# EAGLE design power-hat (EAGLE 9.4.2)
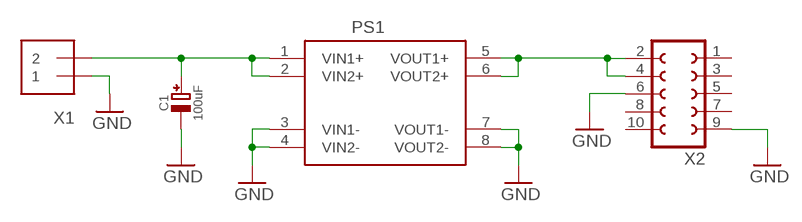
[diagram p0: schematic, sheet 1]

## Parts
C1  100uF  CAP_ELECTROLYTICPTH_3.5MMGRID_8MMDIA  [CELEC_3.5MM_8MM]
PS1  K8801MODULE  [K8801]
X1  WR_TBL_1X2-3.5MM  [WR-TBL-1X2-3.5MM]
X2  FE05-2  [FE05-2]

## Nets
GND: C1.- PS1.3(VIN1-) PS1.4(VIN2-) PS1.7(VOUT1-) PS1.8(VOUT2-) X1.1 X2.6 X2.9
N$2: C1.+ PS1.1(VIN1+) PS1.2(VIN2+) X1.2
PWR: PS1.5(VOUT1+) PS1.6(VOUT2+) X2.2 X2.4
Unconnected: X2.1 X2.3 X2.5 X2.7 X2.8 X2.10

## Library data of the parts
C1 = sanisimov:CAP_ELECTROLYTIC: Electrolytic Capacitors SMT PANASONIC_C - Size C Panasonic Electrolytic Aluminum Capacitor 47µF 16V 20% Electrolytic Capacitor [Digikey: PCE3890TR-ND] PANASONIC_D - Size D Panasonic Electrolytic Aluminum Capacitor 100µF 25V 20% Electrolytic Capacitor [Digikey: PCE3898TR-ND] PTH 3.5 mm grid, 8 mm diameter ... 3.5 mm grid, 10 mm diameter ...
PS1 = sanisimov:K8801: 7V-28V to 5V DC-DC Step Down Power Supply Module Voltage Buck Converter 3A Power Supply Board Input voltage:DC 7V-28V Output valtage:DC 5V Output current:3A. max(2A for long time) Working frequency:570KHz Size:22*17.8*5mm
X1 = sanisimov:WR_TBL_1X2-3.5MM: 3.5mm Terminal block http://www.ladyada.net/library/pcb/eaglelibrary.html
X2 = sanisimov:FE05-2: FEMALE HEADER; OC_FARNELL: unknown; OC_NEWARK: unknown

## Board
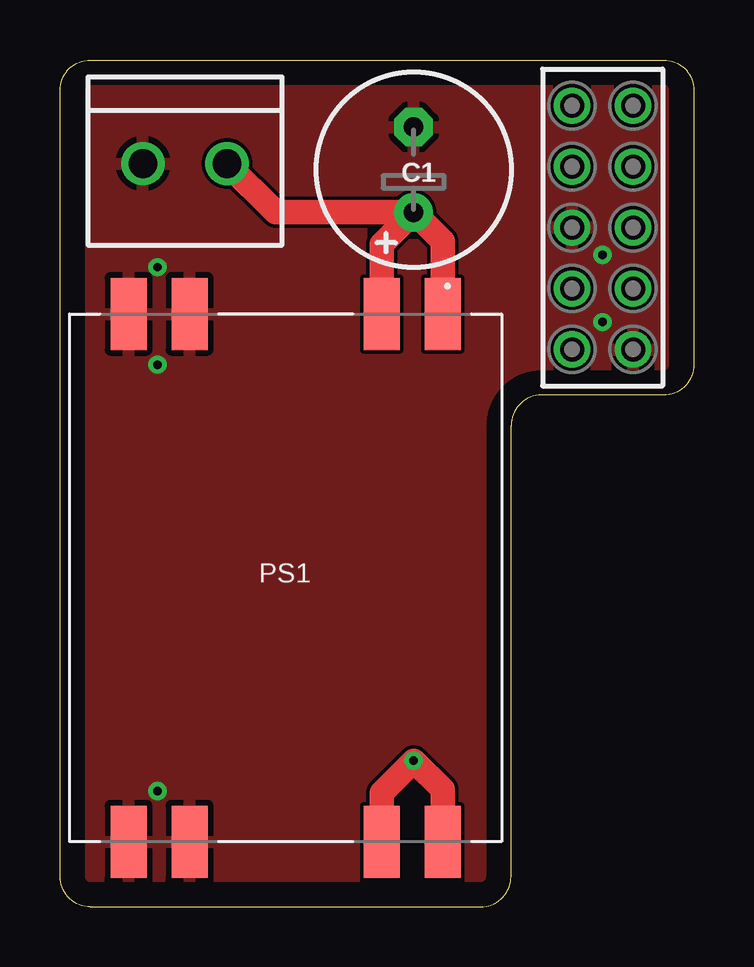
[diagram p1: board, top side]
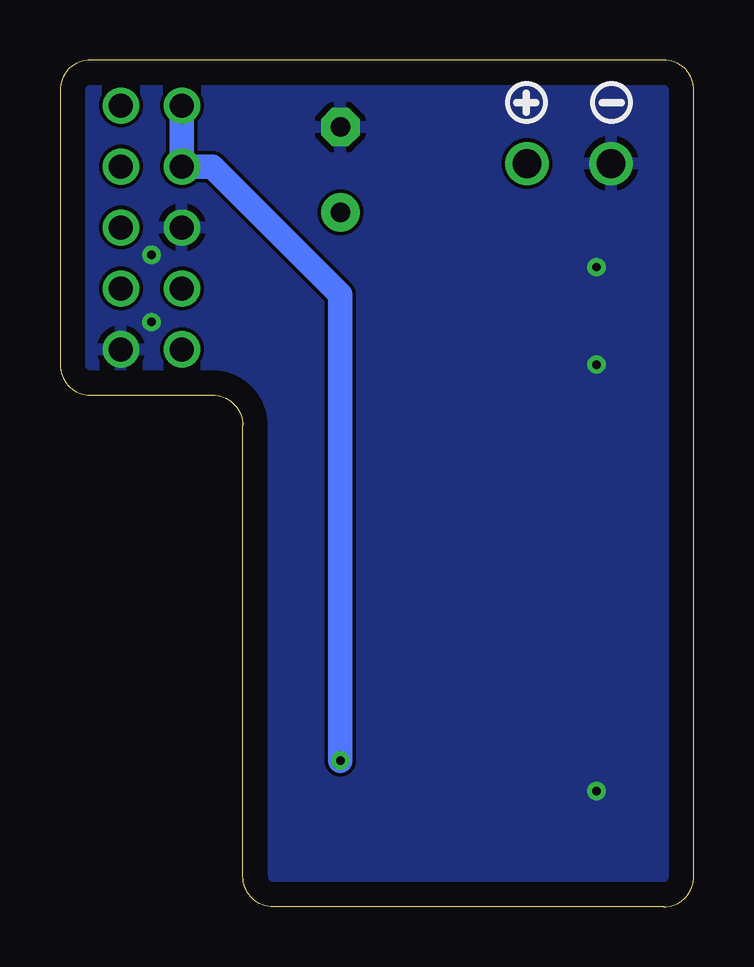
[diagram p2: board, bottom side, seen from below]

Size 26.42 x 35.31 mm. Coordinates in mm from the lower left corner, seen from the top.
Outline: 1.27,35.31 25.15,35.31 arc-90 26.42,34.04 26.42,22.61 arc-90 25.15,21.34 20.07,21.34 arc90 18.8,20.07 18.8,1.27 arc-90 17.53,0 1.27,0 arc-90 0,1.27 0,34.04 arc-90 1.27,35.31
Copper layers (1*16): Top 0.035mm / dielectric 1.5mm / Bottom 0.035mm
Design rules "default *": minimum track width 6mil, minimum drill 0.35mm, track to track 6mil, track to pad 6mil, pad to pad 6mil, via to via 6mil, smd to smd 6mil, copper to edge 40mil, drill to drill 6mil, minimum pad ring 10mil, minimum via ring 8mil, stop-mask expansion 4mil, vias tented up to drill 15mil, thermal gap 10mil

### Footprints (pad centres in the part's own frame; a part is rotated, then mirrored left to right if it is on the bottom)
CELEC_3.5MM_8MM = drill 0.813 pad 1.6: + -1.778,0 | drill 0.813 pad 1.6 octagon: - 1.778,0
K8801 = smd 1.5 x 3: 1 -6.54,-11; 2 -4,-11; 3 4,-11; 4 6.54,-11; 5 -6.54,11; 6 -4,11; 7 4,11; 8 6.54,11
WR-TBL-1X2-3.5MM = drill 1.2: 1 1.75,0; 2 -1.75,0
FE05-2 = drill 1: 1 -5.08,1.27; 2 -5.08,-1.27; 3 -2.54,1.27; 4 -2.54,-1.27; 5 0,1.27; 6 0,-1.27; 7 2.54,1.27; 8 2.54,-1.27; 9 5.08,1.27; 10 5.08,-1.27

### Placement (x,y rotation side)
C1  14.73,30.73 90 top
PS1  9.4,13.72 180 top
U$5  [SYMBOL_PLUS]  6.98,33.53 90 bottom
U$6  [SYMBOL_MINUS]  3.43,33.53 180 bottom
X1  5.21,30.99 180 top
X2  22.61,28.32 270 top

### Tracks (layer width: path | path; a pad name or v marks a point on that pad's centre or on a via)
GND  (via drill 0.35)
  other vias: 4.06,26.67 4.06,22.61 4.06,4.83 22.61,27.18 22.61,24.38
  pour Top: -1.52,-2.29 -1.52,35.81 27.69,35.81 27.69,20.57 20.07,20.57 20.07,-2.29
  pour Bottom: -1.52,35.81 27.69,35.81 27.69,20.57 20.07,20.57 20.07,-2.29 -1.52,-2.29
N$2
  Top 1.016: PS1.1 15.94,27.75 C1.+ | PS1.2 13.4,27.62 C1.+ | X1.2 8.99,28.96 C1.+
PWR  (via drill 0.35)
  Top 1.016: PS1.5 15.94,4.89 v14.73,6.1 13.4,4.76 PS1.6
  Bottom 1.016: X2.2 X2.4 20.07,30.86 14.73,25.53 v14.73,6.1